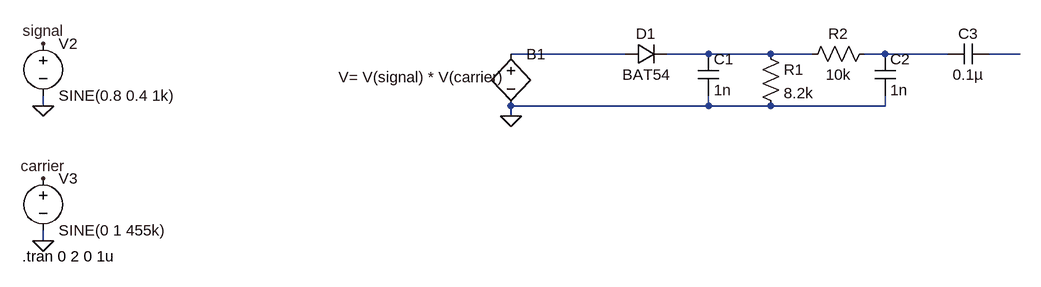
[diagram p0: schematic DemodulatorSimulations.asc]
DemodulatorSimulations.asc, the LTspice schematic file:
Version 4.1
SHEET 1 880 696
WIRE 176 144 0 144
WIRE 304 144 240 144
WIRE 400 144 304 144
WIRE 464 144 400 144
WIRE 576 144 544 144
WIRE 672 144 576 144
WIRE 784 144 736 144
WIRE -720 224 -720 208
WIRE 304 224 304 208
WIRE 304 224 0 224
WIRE 400 224 304 224
WIRE 576 224 576 208
WIRE 576 224 400 224
WIRE 0 240 0 224
WIRE -720 432 -720 416
FLAG -720 432 0
FLAG -720 224 0
FLAG -720 128 signal
FLAG -720 336 carrier
FLAG 0 240 0
SYMBOL diode 176 160 R270
WINDOW 0 32 32 VTop 2
WINDOW 3 0 32 VBottom 2
SYMATTR InstName D1
SYMATTR Value BAT54
SYMATTR Description Diode
SYMATTR Type diode
SYMBOL voltage -720 112 R0
WINDOW 123 0 0 Left 0
WINDOW 39 0 0 Left 0
SYMATTR InstName V2
SYMATTR Value SINE(0.8 0.4 1k)
SYMBOL voltage -720 320 R0
WINDOW 123 0 0 Left 0
WINDOW 39 0 0 Left 0
SYMATTR InstName V3
SYMATTR Value SINE(0 1 455k)
SYMBOL bv 0 128 R0
WINDOW 3 -265 52 Left 2
SYMATTR InstName B1
SYMATTR Value V= V(signal) * V(carrier)
SYMBOL cap 288 144 R0
SYMATTR InstName C1
SYMATTR Value 1n
SYMBOL res 384 128 R0
SYMATTR InstName R1
SYMATTR Value 8.2k
SYMBOL res 560 128 R90
WINDOW 0 0 56 VBottom 2
WINDOW 3 32 56 VTop 2
SYMATTR InstName R2
SYMATTR Value 10k
SYMBOL cap 560 144 R0
SYMATTR InstName C2
SYMATTR Value 1n
SYMBOL cap 736 128 R90
WINDOW 0 0 32 VBottom 2
WINDOW 3 32 32 VTop 2
SYMATTR InstName C3
SYMATTR Value 0.1µ
TEXT -752 456 Left 2 !.tran 0 2 0 1u

The netlist it stands for:
* DemodulatorSimulations.asc
D1 N001 N002 BAT54
V2 signal 0 SINE(0.8 0.4 1k)
V3 carrier 0 SINE(0 1 455k)
B1 N001 0 V= V(signal) * V(carrier)
C1 N002 0 1n
R1 N002 0 8.2k
R2 N003 N002 10k
C2 N003 0 1n
C3 N004 N003 0.1µ
.model D D
.lib standard.dio
.tran 0 2 0 1u
.backanno
.end